# EAGLE design HoneyPI_Platine_2.02 (EAGLE 9.6.2)
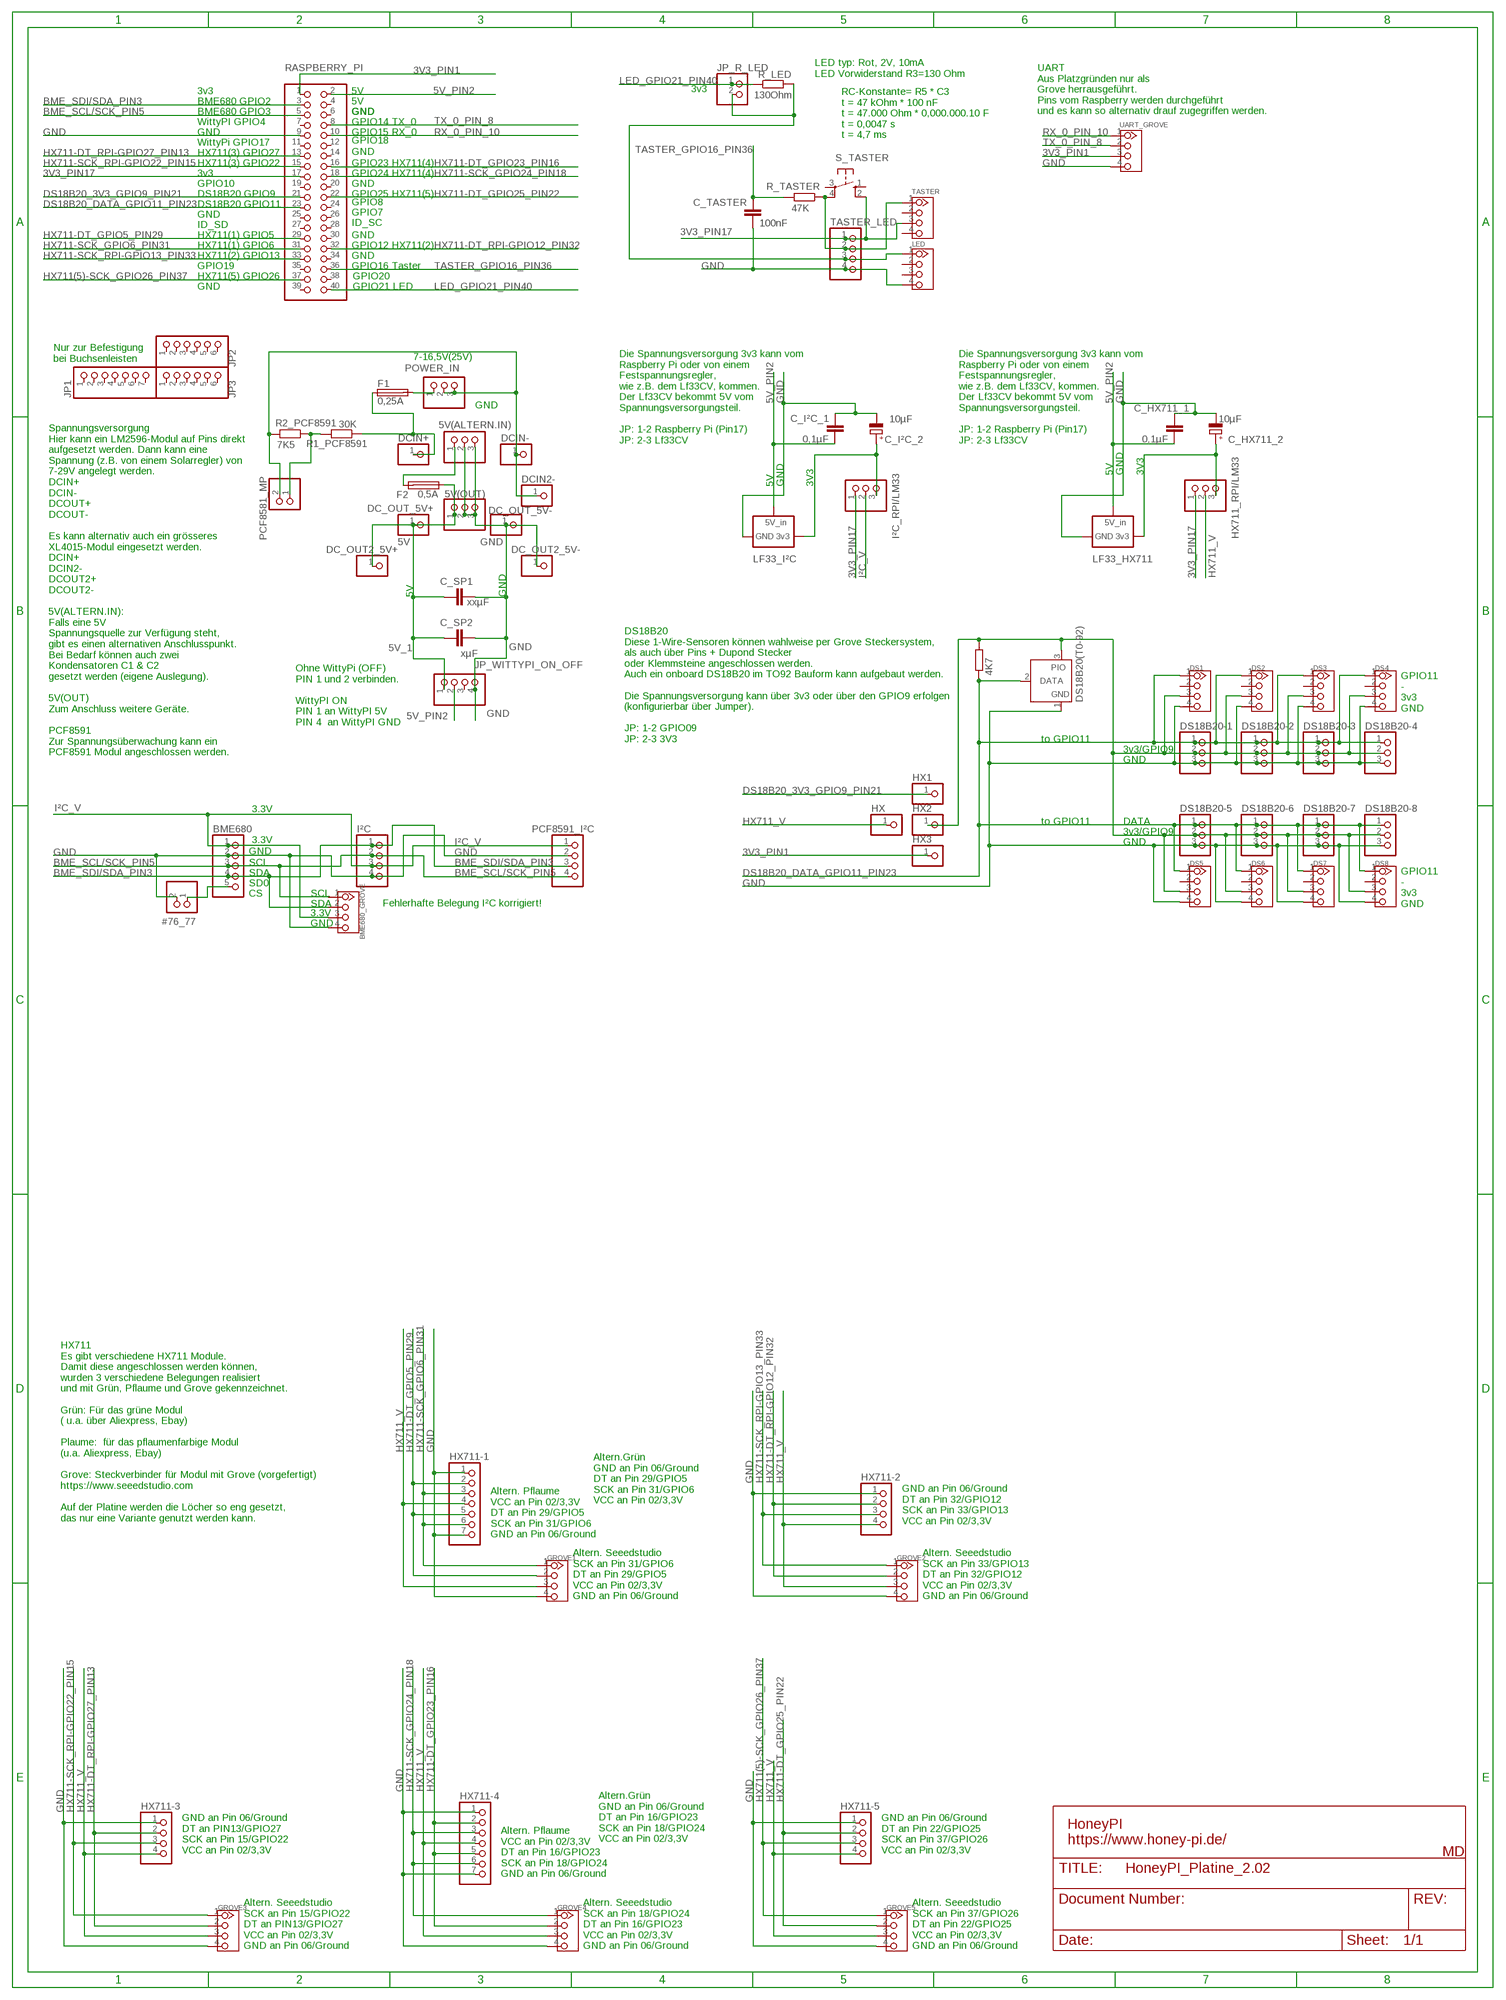
[diagram p0: schematic, sheet 1]

## Parts
5V(ALTERN.IN)  PINHD-1X3  [1X03]
5V(OUT)  PINHD-1X3  [1X03]
#76_77  PINHD-1X2  [1X02]
BME680  PINHD-1X5  [1X05]
BME680_GROVE  TWIG-4P-2.0-2.0  [4P-2.0]
C_HX711_1  0,1µF  C2,5-3  [C2.5-3]
C_HX711_2  10µF  CPOL-EUE2-5  [E2-5]
C_I²C_1  0,1µF  C2,5-3  [C2.5-3]
C_I²C_2  10µF  CPOL-EUE2-5  [E2-5]
C_SP1  xxµF  C2,5-3  [C2.5-3]
C_SP2  xµF  C2,5-3  [C2.5-3]
C_TASTER  100nF  C2,5-3  [C2.5-3]
DC_OUT2_5V+  PINHD-1X1  [1X01]
DC_OUT2_5V-  PINHD-1X1  [1X01]
DC_OUT_5V+  5V  PINHD-1X1  [1X01]
DC_OUT_5V-  GND  PINHD-1X1  [1X01]
DCIN2-  PINHD-1X1  [1X01]
DCIN+  PINHD-1X1  [1X01]
DCIN-  PINHD-1X1  [1X01]
DS1  TWIG-4P-2.0-2.0  [4P-2.0]
DS2  TWIG-4P-2.0-2.0  [4P-2.0]
DS3  TWIG-4P-2.0-2.0  [4P-2.0]
DS4  TWIG-4P-2.0-2.0  [4P-2.0]
DS5  TWIG-4P-2.0-2.0  [4P-2.0]
DS6  TWIG-4P-2.0-2.0  [4P-2.0]
DS7  TWIG-4P-2.0-2.0  [4P-2.0]
DS8  TWIG-4P-2.0-2.0  [4P-2.0]
DS18B20(T0-92)  DS18b20  DS2405  [TO92-]
DS18B20-1  PINHD-1X3  [1X03]
DS18B20-2  PINHD-1X3  [1X03]
DS18B20-3  PINHD-1X3  [1X03]
DS18B20-4  PINHD-1X3  [1X03]
DS18B20-5  PINHD-1X3  [1X03]
DS18B20-6  PINHD-1X3  [1X03]
DS18B20-7  PINHD-1X3  [1X03]
DS18B20-8  PINHD-1X3  [1X03]
F1  0,25A  TR5  [TR5]
F2  0,5A  TR5  [TR5]
GROVE1  TWIG-4P-2.0-2.0  [4P-2.0]
GROVE2  TWIG-4P-2.0-2.0  [4P-2.0]
GROVE3  TWIG-4P-2.0-2.0  [4P-2.0]
GROVE4  TWIG-4P-2.0-2.0  [4P-2.0]
GROVE5  TWIG-4P-2.0-2.0  [4P-2.0]
HX  PINHD-1X1  [1X01]
HX1  PINHD-1X1  [1X01]
HX2  PINHD-1X1  [1X01]
HX3  PINHD-1X1  [1X01]
HX711-1  PINHD-1X7  [1X07]
HX711-2  PINHD-1X4  [1X04]
HX711-3  PINHD-1X4  [1X04]
HX711-4  PINHD-1X7  [1X07]
HX711-5  PINHD-1X4  [1X04]
HX711_RPI/LM33  PINHD-1X3  [1X03]
I²C  PINHD-1X4  [1X04]
I²C_RPI/LM33  PINHD-1X3  [1X03]
JP1  PINHD-1X7  [1X07]
JP2  PINHD-1X6  [1X06]
JP3  PINHD-1X6  [1X06]
JP_R_LED  PINHD-1X2  [1X02]
JP_WITTYPI_ON_OFF  PINHD-1X4  [1X04]
LED  TWIG-4P-2.0-2.0  [4P-2.0]
LF33_HX711  LM33CV  [337TS]
LF33_I²C  LM33CV  [337TS]
PCF8581_MP  PINHD-1X2  [1X02]
PCF8591_I²C  PINHD-1X4  [1X04]
POWER_IN  PINHD-1X3  [1X03]
R1_PCF8591  30K  R-EU_0204/7  [0204/7]
R2_PCF8591  7K5  R-EU_0204/7  [0204/7]
R_DS18B20  4K7  R-EU_0204/7  [0204/7]
R_LED  130Ohm  R-EU_0204/7  [0204/7]
R_TASTER  47K  R-EU_0204/7  [0204/7]
RASPBERRY_PI  PINHD-2X20  [2X20]
S_TASTER  10-XX  [B3F-10XX]
TASTER  TWIG-4P-2.0-2.0  [4P-2.0]
TASTER_LED  PINHD-1X4  [1X04]
UART_GROVE  TWIG-4P-2.0-2.0  [4P-2.0]

## Nets
3V3 [Supply3v3]: DS1.3 DS2.3 DS3.3 DS4.3 DS5.3 DS6.3 DS7.3 DS8.3 DS18B20(T0-92).3(PIO) DS18B20-1.2 DS18B20-2.2 DS18B20-3.2 DS18B20-4.2 DS18B20-5.2 DS18B20-6.2 DS18B20-7.2 DS18B20-8.2 HX2.1 R_DS18B20.2
3V3_PIN1 [Supply3v3]: HX3.1 RASPBERRY_PI.1 UART_GROVE.3
3V3_PIN17 [Supply3v3]: HX711_RPI/LM33.1 I²C_RPI/LM33.1 RASPBERRY_PI.17 S_TASTER.2(S1) TASTER.3 TASTER_LED.1
5V_1: 5V(OUT).1 C_SP1.1 C_SP2.1 DC_OUT2_5V+.1 DC_OUT_5V+.1 F2.1 JP_WITTYPI_ON_OFF.1
5V_PIN2 [Supply5v]: C_HX711_1.1 C_I²C_1.1 JP_WITTYPI_ON_OFF.2 LF33_HX711.1(5V) LF33_I²C.1(5V) RASPBERRY_PI.2
BME_SCL/SCK_PIN5: BME680.3 BME680_GROVE.1 I²C.2 PCF8591_I²C.4 RASPBERRY_PI.5
BME_SDI/SDA_PIN3: BME680.4 BME680_GROVE.2 I²C.1 PCF8591_I²C.3 RASPBERRY_PI.3
DS18B20_3V3_GPIO9_PIN21 [Supply3v3]: HX1.1 RASPBERRY_PI.21
DS18B20_DATA_GPIO11_PIN23: DS1.1 DS2.1 DS3.1 DS4.1 DS5.1 DS6.1 DS7.1 DS8.1 DS18B20(T0-92).2(DATA) DS18B20-1.1 DS18B20-2.1 DS18B20-3.1 DS18B20-4.1 DS18B20-5.1 DS18B20-6.1 DS18B20-7.1 DS18B20-8.1 R_DS18B20.1 RASPBERRY_PI.23
GND [Supply5v]: 5V(ALTERN.IN).2 5V(ALTERN.IN).3 5V(OUT).2 5V(OUT).3 #76_77.2 BME680.2 BME680_GROVE.4 C_HX711_1.2 C_HX711_2.- C_I²C_1.2 C_I²C_2.- C_SP1.2 C_SP2.2 C_TASTER.1 DC_OUT2_5V-.1 DC_OUT_5V-.1 DS1.4 DS2.4 DS3.4 DS4.4 DS5.4 DS6.4 DS7.4 DS8.4 DS18B20(T0-92).1(GND) DS18B20-1.3 DS18B20-2.3 DS18B20-3.3 DS18B20-4.3 DS18B20-5.3 DS18B20-6.3 DS18B20-7.3 DS18B20-8.3 GROVE1.4 GROVE2.4 GROVE3.4 GROVE4.4 GROVE5.4 HX711-1.1 HX711-1.7 HX711-2.1 HX711-3.1 HX711-4.1 HX711-4.7 HX711-5.1 I²C.4 JP_WITTYPI_ON_OFF.4 LED.4 LF33_HX711.2(GND) LF33_I²C.2(GND) PCF8591_I²C.2 RASPBERRY_PI.9 TASTER_LED.4 UART_GROVE.4
GND20V [Suppy20V]: DCIN2-.1 DCIN-.1 PCF8581_MP.2 POWER_IN.2 POWER_IN.3 R2_PCF8591.2
HX711(5)-SCK_GPIO26_PIN37: GROVE5.1 HX711-5.3 RASPBERRY_PI.37
HX711-DT_GPIO5_PIN29: GROVE1.2 HX711-1.2 HX711-1.5 RASPBERRY_PI.29
HX711-DT_GPIO23_PIN16: GROVE4.2 HX711-4.2 HX711-4.5 RASPBERRY_PI.16
HX711-DT_GPIO25_PIN22: GROVE5.2 HX711-5.2 RASPBERRY_PI.22
HX711-DT_RPI-GPIO12_PIN32: GROVE2.2 HX711-2.2 RASPBERRY_PI.32
HX711-DT_RPI-GPIO27_PIN13: GROVE3.2 HX711-3.2 RASPBERRY_PI.13
HX711-SCK_GPIO6_PIN31: GROVE1.1 HX711-1.3 HX711-1.6 RASPBERRY_PI.31
HX711-SCK_GPIO24_PIN18: GROVE4.1 HX711-4.3 HX711-4.6 RASPBERRY_PI.18
HX711-SCK_RPI-GPIO13_PIN33: GROVE2.1 HX711-2.3 RASPBERRY_PI.33
HX711-SCK_RPI-GPIO22_PIN15: GROVE3.1 HX711-3.3 RASPBERRY_PI.15
HX711_V [Supply3v3]: GROVE1.3 GROVE2.3 GROVE3.3 GROVE4.3 GROVE5.3 HX711-1.4 HX711-2.4 HX711-3.4 HX711-4.4 HX711-5.4 HX711_RPI/LM33.2 HX.1
I²C_V [Supply3v3]: BME680.1 BME680_GROVE.3 I²C.3 I²C_RPI/LM33.2 PCF8591_I²C.1
LED_2: JP_R_LED.2 LED.1 R_LED.2 TASTER_LED.3
LED_GPIO21_PIN40 [Supply3v3]: JP_R_LED.1 R_LED.1 RASPBERRY_PI.40
N$2: C_I²C_2.+ I²C_RPI/LM33.3 LF33_I²C.3(OUT3V3)
N$3: R_TASTER.1 S_TASTER.4(P1) TASTER.1 TASTER_LED.2
N$4: C_HX711_2.+ HX711_RPI/LM33.3 LF33_HX711.3(OUT3V3)
N$8: #76_77.1 BME680.5
N$9 [Supply5v]: 5V(ALTERN.IN).1 F2.2
RX_0_PIN_10: RASPBERRY_PI.10 UART_GROVE.1
SPANNUNGSTEILER1: PCF8581_MP.1 R1_PCF8591.2 R2_PCF8591.1
TASTER_GPIO16_PIN36: C_TASTER.2 R_TASTER.2 RASPBERRY_PI.36
TX_0_PIN_8: RASPBERRY_PI.8 UART_GROVE.2
VDD20V1 [Suppy20V]: DCIN+.1 F1.1 R1_PCF8591.1
VDD20V2 [Suppy20V]: F1.2 POWER_IN.1
Unconnected: DS1.2 DS2.2 DS3.2 DS4.2 DS5.2 DS6.2 DS7.2 DS8.2 JP1.1 JP1.2 JP1.3 JP1.4 JP1.5 JP1.6 JP1.7 JP2.1 JP2.2 JP2.3 JP2.4 JP2.5 JP2.6 JP3.1 JP3.2 JP3.3 JP3.4 JP3.5 JP3.6 JP_WITTYPI_ON_OFF.3 LED.2 LED.3 RASPBERRY_PI.4 RASPBERRY_PI.6 RASPBERRY_PI.7 RASPBERRY_PI.11 RASPBERRY_PI.12 RASPBERRY_PI.14 RASPBERRY_PI.19 RASPBERRY_PI.20 RASPBERRY_PI.24 RASPBERRY_PI.25 RASPBERRY_PI.26 RASPBERRY_PI.27 RASPBERRY_PI.28 RASPBERRY_PI.30 RASPBERRY_PI.34 RASPBERRY_PI.35 RASPBERRY_PI.38 RASPBERRY_PI.39 S_TASTER.1(S) S_TASTER.3(P) TASTER.2 TASTER.4

## Notes on the sheet
- LED typ: Rot, 2V, 10mA
  LED Vorwiderstand R3=130 Ohm
- 3v3 | 5V | 3v3
- BME680 GPIO2 | 5V
- BME680 GPIO3 | GND | GND
- WittyPI GPIO4 | GPIO14 TX_0
- UART
  Aus Platzgründen nur als
  Grove herrausgeführt. 
  Pins vom Raspberry werden durchgeführt
  und es kann so alternativ drauf zugegriffen werden.
- GND | GPIO15 RX_0
- WittyPi GPIO17 | GPIO18
- RC-Konstante= R5 * C3
  t = 47 kOhm * 100 nF    
  t = 47.000 Ohm * 0,000.000.10 F
  t = 0,0047 s
  t = 4,7 ms
- HX711(3) GPIO27 | GND
- HX711(3) GPIO22 | GPIO23 HX711(4)
- 3v3 | GPIO24 HX711(4)
- GPIO10 | GND
- DS18B20 GPIO9 | GPIO25 HX711(5)
- DS18B20 GPIO11 | GPIO8
- GND | GPIO7
- ID_SD | ID_SC
- HX711(1) GPIO5 | GND
- HX711(1) GPIO6 | GPIO12 HX711(2)
- HX711(2) GPIO13 | GND
- GPIO19 | GPIO16 Taster
- HX711(5) GPIO26 | GPIO20
- GND | GPIO21 LED
- 7-16,5V(25V)
- Nur zur Befestigung
  bei Buchsenleisten
- GND
- Die Spannungsversorgung 3v3 kann vom
  Raspberry Pi oder von einem 
  Festspannungsregler, 
  wie z.B. dem Lf33CV, kommen.
  Der Lf33CV bekommt 5V vom
  Spannungsversorgungsteil.
  
  JP: 1-2 Raspberry Pi (Pin17)
  JP: 2-3 Lf33CV
- Die Spannungsversorgung 3v3 kann vom
  Raspberry Pi oder von einem 
  Festspannungsregler, 
  wie z.B. dem Lf33CV, kommen.
  Der Lf33CV bekommt 5V vom
  Spannungsversorgungsteil.
  
  JP: 1-2 Raspberry Pi (Pin17)
  JP: 2-3 Lf33CV
- 5V | GND | 3V3
- 5V | GND | 3V3
- 5V | GND
- GPIO11
  -
  3v3
  GND
- Ohne WittyPi (OFF)
  PIN 1 und 2 verbinden.
  
  WittyPI ON
  PIN 1 an WittyPI 5V 
  PIN 4  an WittyPI GND
- DS18B20
  Diese 1-Wire-Sensoren können wahlweise per Grove Steckersystem,
  als auch über Pins + Dupond Stecker
  oder Klemmsteine angeschlossen werden.
  Auch ein onboard DS18B20 im TO92 Bauform kann aufgebaut werden. 
  
  Die Spannungsversorgung kann über 3v3 oder über den GPIO9 erfolgen
  (konfigurierbar über Jumper).
  
  JP: 1-2 GPIO09
  JP: 2-3 3V3
- to GPIO11
- 3v3/GPIO9
- Spannungsversorgung
  Hier kann ein LM2596-Modul auf Pins direkt
  aufgesetzt werden. Dann kann eine
  Spannung (z.B. von einem Solarregler) von
  7-29V angelegt werden.
  DCIN+
  DCIN-
  DCOUT+
  DCOUT-
  
  Es kann alternativ auch ein grösseres
  XL4015-Modul eingesetzt werden. 
  DCIN+
  DCIN2-
  DCOUT2+
  DCOUT2-
  
  5V(ALTERN.IN):
  Falls eine 5V
  Spannungsquelle zur Verfügung steht,
  gibt es einen alternativen Anschlusspunkt.
  Bei Bedarf können auch zwei
  Kondensatoren C1 & C2
  gesetzt werden (eigene Auslegung).   
  
  5V(OUT)
  Zum Anschluss weitere Geräte.
  
  PCF8591
  Zur Spannungsüberwachung kann ein
  PCF8591 Modul angeschlossen werden.
- GND
- 3.3V
- to GPIO11 | DATA
- 3v3/GPIO9
- 3.3V | GND
- GND
- SCL
- SDA
- SD0
- CS | SCL
- SDA
- GPIO11
  -
  3v3
  GND
- 3.3V | Fehlerhafte Belegung I²C korrigiert!
- GND
- Altern.Grün
  GND an Pin 06/Ground
  DT an Pin 29/GPIO5
  SCK an Pin 31/GPIO6
  VCC an Pin 02/3,3V
- HX711
  Es gibt verschiedene HX711 Module.
  Damit diese angeschlossen werden können,
  wurden 3 verschiedene Belegungen realisiert
  und mit Grün, Pflaume und Grove gekennzeichnet.
  
  Grün: Für das grüne Modul 
  ( u.a. über Aliexpress, Ebay)
  
  Plaume:  für das pflaumenfarbige Modul 
  (u.a. Aliexpress, Ebay) 
  
  Grove: Steckverbinder für Modul mit Grove (vorgefertigt)
  https://www.seeedstudio.com
  
  Auf der Platine werden die Löcher so eng gesetzt,
  das nur eine Variante genutzt werden kann.
- GND an Pin 06/Ground
  DT an Pin 32/GPIO12
  SCK an Pin 33/GPIO13
  VCC an Pin 02/3,3V
- Altern. Pflaume
  VCC an Pin 02/3,3V
  DT an Pin 29/GPIO5
  SCK an Pin 31/GPIO6
  GND an Pin 06/Ground
- Altern. Seeedstudio
  SCK an Pin 31/GPIO6
  DT an Pin 29/GPIO5
  VCC an Pin 02/3,3V
  GND an Pin 06/Ground
- Altern. Seeedstudio
  SCK an Pin 33/GPIO13
  DT an Pin 32/GPIO12
  VCC an Pin 02/3,3V
  GND an Pin 06/Ground
- Altern.Grün
  GND an Pin 06/Ground
  DT an Pin 16/GPIO23
  SCK an Pin 18/GPIO24
  VCC an Pin 02/3,3V
- HoneyPI
  https://www.honey-pi.de/
- GND an Pin 06/Ground
  DT an PIN13/GPIO27
  SCK an Pin 15/GPIO22
  VCC an Pin 02/3,3V
- GND an Pin 06/Ground
  DT an Pin 22/GPIO25
  SCK an Pin 37/GPIO26
  VCC an Pin 02/3,3V
- MD
- Altern. Pflaume
  VCC an Pin 02/3,3V
  DT an Pin 16/GPIO23
  SCK an Pin 18/GPIO24
  GND an Pin 06/Ground
- Altern. Seeedstudio
  SCK an Pin 15/GPIO22
  DT an PIN13/GPIO27
  VCC an Pin 02/3,3V
  GND an Pin 06/Ground
- Altern. Seeedstudio
  SCK an Pin 18/GPIO24
  DT an Pin 16/GPIO23
  VCC an Pin 02/3,3V
  GND an Pin 06/Ground
- Altern. Seeedstudio
  SCK an Pin 37/GPIO26
  DT an Pin 22/GPIO25
  VCC an Pin 02/3,3V
  GND an Pin 06/Ground

## Library data of the parts
5V(ALTERN.IN) 5V(OUT) DS18B20-1-DS18B20-8 HX711_RPI/LM33 I²C_RPI/LM33 POWER_IN = pinhead:PINHD-1X3: PIN HEADER
#76_77 JP_R_LED PCF8581_MP = pinhead:PINHD-1X2: PIN HEADER
BME680 = pinhead:PINHD-1X5: PIN HEADER
BME680_GROVE DS1-DS8 GROVE1-GROVE5 LED TASTER UART_GROVE = Connector:TWIG-4P-2.0: Grove Stecker RM 2mm 4Pol
C_HX711_1 C_I²C_1 C_SP1 C_SP2 C_TASTER = capacitor-wima:C: CAPACITOR
C_HX711_2 C_I²C_2 = rcl:CPOL-EU: POLARIZED CAPACITOR, European symbol; SPICEPREFIX: C
DC_OUT2_5V+ DC_OUT2_5V- DC_OUT_5V+ DC_OUT_5V- DCIN2- DCIN+ DCIN- HX HX1-HX3 = pinhead:PINHD-1X1: PIN HEADER
DS18B20(T0-92) = maxim:DS2405: Addressable Switch DALLAS Semiconductor; MF: DALLAS SEMICONDUCTOR; MPN: DS2405; OC_FARNELL: 1188025; OC_NEWARK: 06F4645
F1 F2 = fuse:TR5: FUSE; OC_FARNELL: unknown; OC_NEWARK: unknown
HX711-1 HX711-4 JP1 = pinhead:PINHD-1X7: PIN HEADER
HX711-2 HX711-3 HX711-5 I²C JP_WITTYPI_ON_OFF PCF8591_I²C TASTER_LED = pinhead:PINHD-1X4: PIN HEADER
JP2 JP3 = pinhead:PINHD-1X6: PIN HEADER
LF33_HX711 LF33_I²C = LM33cv:LM33CV: VOLTAGE REGULATOR
R1_PCF8591 R2_PCF8591 R_DS18B20 R_LED R_TASTER = rcl:R-EU_: RESISTOR, European symbol; SPICEPREFIX: R
RASPBERRY_PI = pinhead:PINHD-2X20: PIN HEADER
S_TASTER = switch-omron:10-XX: OMRON SWITCH; MPN: B3F-1000; OC_FARNELL: 176432; OC_NEWARK: 36M3542

## Net classes
0 Signal: width 0.152 mm, clearance 0.254 mm
1 Supply3v3: width 0.152 mm, clearance 0.305 mm
2 Supply5v: width 0.5 mm, clearance 0.254 mm
4 Suppy20V: width 0.25 mm, clearance 0.762 mm

## Board
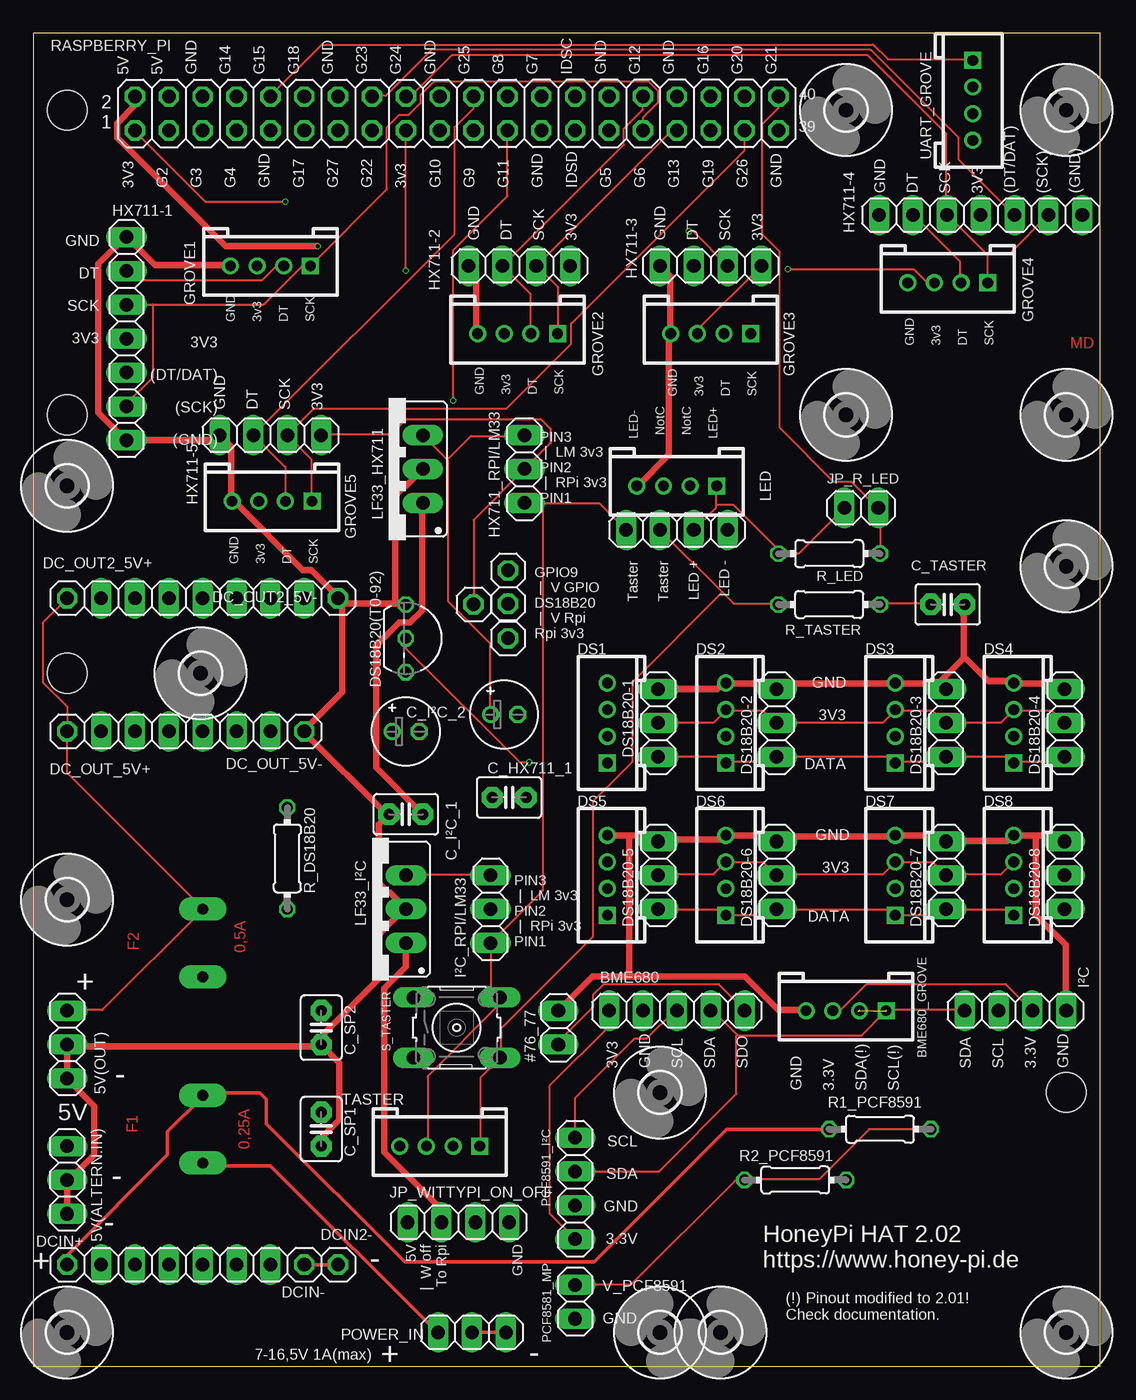
[diagram p1: board, top side]
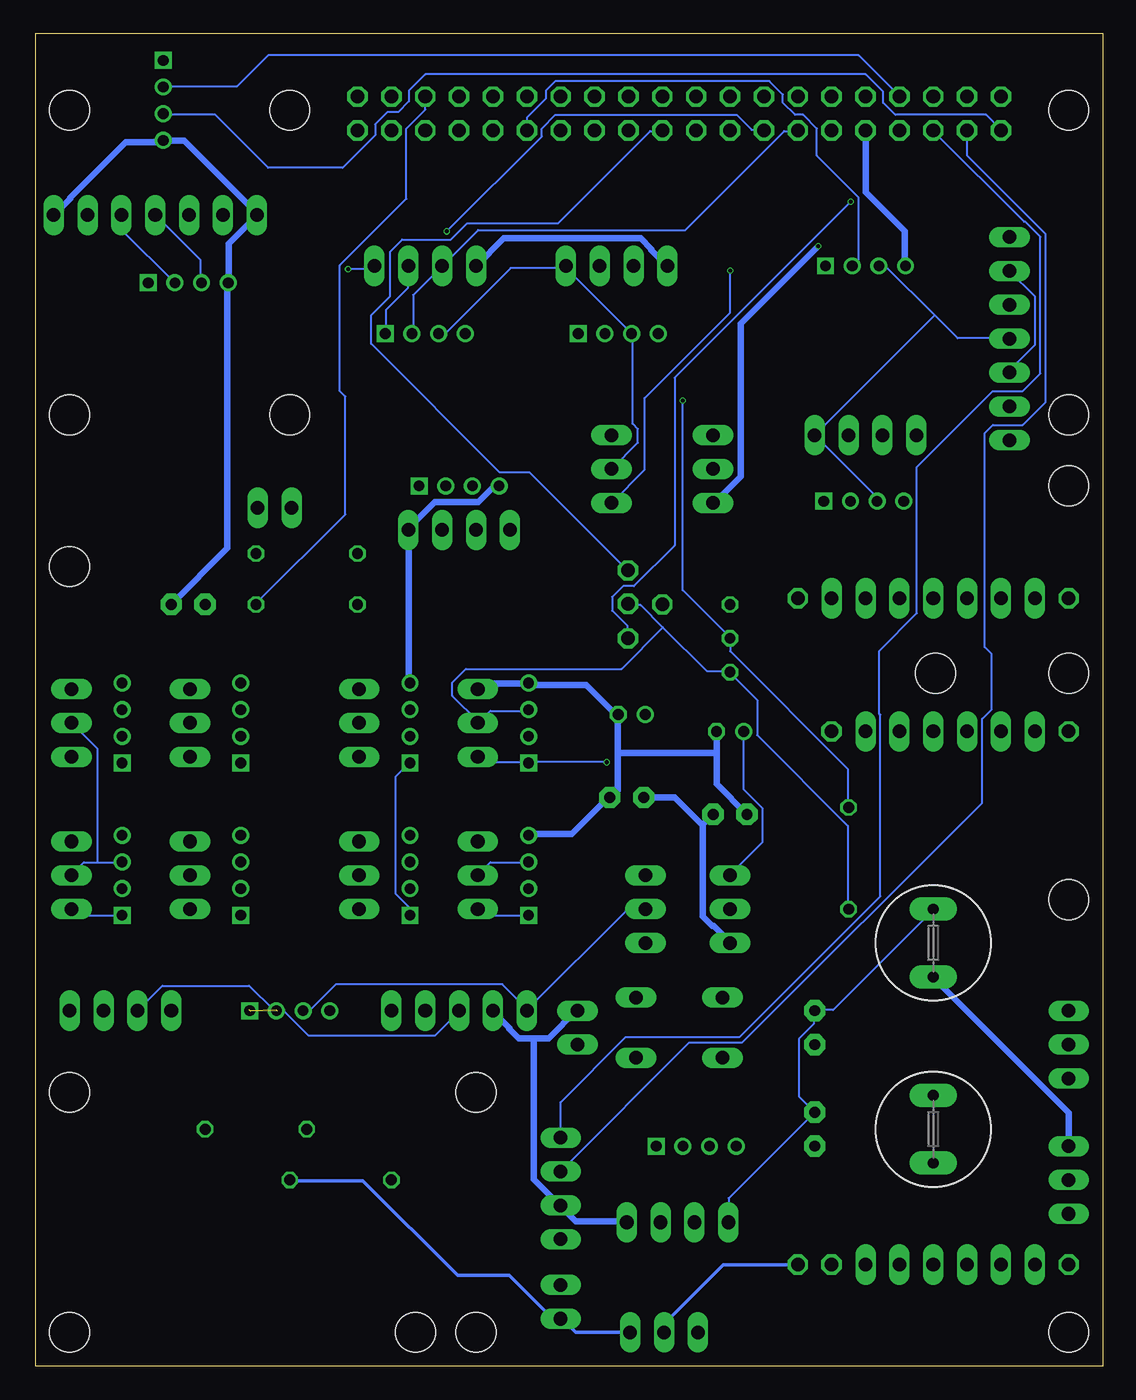
[diagram p2: board, bottom side, seen from below]

Size 80 x 100 mm. Coordinates in mm from the lower left corner, seen from the top.
Outline: 0,0 80,0 80,100 0,100 0,0
Copper layers (1*16): Top 0.035559375mm / dielectric 1.6mm / Bottom 0.035559375mm
Design rules "jlcpcb2layer": minimum track width 5mil, minimum drill 12mil, track to track 5mil, track to pad 5mil, pad to pad 5mil, via to via 5mil, smd to smd 5mil, copper to edge 8mil, drill to drill 6mil, minimum pad ring 5mil, minimum via ring 3mil, stop-mask expansion 2.5mil, vias tented up to drill 0mil, thermal gap 10mil
Holes 3 mm at 2.54,94.23 2.54,71.37 77.47,20.54 2.54,52

### Footprints (pad centres in the part's own frame; a part is rotated, then mirrored left to right if it is on the bottom)
1X03 = drill 1.016 long: 1 -2.54,0; 2 0,0; 3 2.54,0
1X02 = drill 1.016 long: 1 -1.27,0; 2 1.27,0
1X05 = drill 1.016 long: 1 -5.08,0; 2 -2.54,0; 3 0,0; 4 2.54,0; 5 5.08,0
4P-2.0 = drill 0.8 pad 1.27 square: 1 -3,0 | drill 0.8 pad 1.27: 2 -1,0; 3 1,0; 4 3,0
C2.5-3 = drill 0.813 pad 1.6 octagon: 1 -1.27,0; 2 1.27,0
E2-5 = drill 0.813 pad 1.27: + -1.016,0 | drill 0.813 pad 1.27 octagon: - 1.016,0
1X01 = drill 1.016 octagon: 1 0,0
TO92- = drill 0.813 octagon: 1 -2.54,0; 2 0,0; 3 2.54,0
TR5 = drill 0.813 pad 1.778 long: 1 -2.54,0; 2 2.54,0
1X07 = drill 1.016 long: 1 -7.62,0; 2 -5.08,0; 3 -2.54,0; 4 0,0; 5 2.54,0; 6 5.08,0; 7 7.62,0
1X04 = drill 1.016 long: 1 -3.81,0; 2 -1.27,0; 3 1.27,0; 4 3.81,0
1X06 = drill 1.016 long: 1 -6.35,0; 2 -3.81,0; 3 -1.27,0; 4 1.27,0; 5 3.81,0; 6 6.35,0
337TS = drill 1.016 long: 1 -2.54,-2.54; 2 0,-2.54; 3 2.54,-2.54
0204/7 = drill 0.813 octagon: 1 -3.81,0; 2 3.81,0
2X20 = drill 1.016 octagon: 1 -24.13,-1.27; 2 -24.13,1.27; 3 -21.59,-1.27; 4 -21.59,1.27; 5 -19.05,-1.27; 6 -19.05,1.27; 7 -16.51,-1.27; 8 -16.51,1.27; 9 -13.97,-1.27; 10 -13.97,1.27; 11 -11.43,-1.27; 12 -11.43,1.27; 13 -8.89,-1.27; 14 -8.89,1.27; 15 -6.35,-1.27; 16 -6.35,1.27; 17 -3.81,-1.27; 18 -3.81,1.27; 19 -1.27,-1.27; 20 -1.27,1.27; 21 1.27,-1.27; 22 1.27,1.27; 23 3.81,-1.27; 24 3.81,1.27; 25 6.35,-1.27; 26 6.35,1.27; 27 8.89,-1.27; 28 8.89,1.27; 29 11.43,-1.27; 30 11.43,1.27; 31 13.97,-1.27; 32 13.97,1.27; 33 16.51,-1.27; 34 16.51,1.27; 35 19.05,-1.27; 36 19.05,1.27; 37 21.59,-1.27; 38 21.59,1.27; 39 24.13,-1.27; 40 24.13,1.27
B3F-10XX = drill 1.016 long: 1 -3.251,2.261; 2 3.251,2.261; 3 -3.251,-2.261; 4 3.251,-2.261
3,0 = hole 3: 0,0

### Placement (x,y rotation side)
5V(ALTERN.IN)  2.54,13.97 270 top
5V(OUT)  2.54,24.13 270 top
#76_77  39.37,25.4 90 top
BME680  48.26,26.67 0 top
BME680_GROVE  60.96,26.67 180 top
C_HX711_1  35.69,42.67 0 top
C_HX711_2  35.31,48.9 0 top
C_I²C_1  27.94,41.4 180 top
C_I²C_2  27.94,47.62 0 top
C_SP1  21.59,17.78 270 top
C_SP2  21.59,25.4 270 top
C_TASTER  68.58,57.15 180 top
DC_OUT2_5V+  2.54,57.62 0 top
DC_OUT2_5V-  22.86,57.62 0 top
DC_OUT_5V+  2.54,47.62 0 top
DC_OUT_5V-  20.32,47.62 0 top
DCIN2-  22.86,7.62 0 top
DCIN+  2.54,7.62 0 top
DCIN-  20.32,7.62 0 top
DS1  43.05,48.26 90 top
DS2  51.94,48.26 90 top
DS3  64.64,48.26 90 top
DS4  73.53,48.26 90 top
DS5  43.05,36.83 90 top
DS6  51.94,36.83 90 top
DS7  64.64,36.83 90 top
DS8  73.53,36.83 90 top
DS18B20(T0-92)  27.94,54.61 270 top
DS18B20-1  46.86,48.26 90 top
DS18B20-2  55.75,48.26 90 top
DS18B20-3  68.45,48.26 90 top
DS18B20-4  77.34,48.26 90 top
DS18B20-5  46.86,36.83 90 top
DS18B20-6  55.75,36.83 90 top
DS18B20-7  68.45,36.83 90 top
DS18B20-8  77.34,36.83 90 top
F1  12.7,17.78 270 bottom
F2  12.7,31.75 270 bottom
GROVE1  17.78,82.55 180 top
GROVE2  36.32,77.47 180 top
GROVE3  50.8,77.47 180 top
GROVE4  68.58,81.28 180 top
GROVE5  17.91,64.9 180 top
HX  33.02,57.15 0 top
HX1  35.6,59.7 0 top
HX2  35.6,57.2 0 top
HX3  35.6,54.6 0 top
HX711-1  6.99,77.09 270 top
HX711-2  36.45,82.55 0 top
HX711-3  50.8,82.55 0 top
HX711-4  71.05,86.36 0 top
HX711-5  17.78,69.85 0 top
HX711_RPI/LM33  36.83,67.31 90 top
I²C  73.66,26.67 0 top
I²C_RPI/LM33  34.29,34.29 90 top
JP1  12.7,57.62 0 top
JP2  11.43,7.62 0 top
JP3  11.43,47.62 0 top
JP_R_LED  62.1,64.4 180 top
JP_WITTYPI_ON_OFF  31.88,10.79 0 top
LED  48.26,66.04 180 top
LF33_HX711  26.67,67.31 90 top
LF33_I²C  25.4,34.29 90 top
PCF8581_MP  40.64,4.83 270 top
PCF8591_I²C  40.64,13.34 90 top
POWER_IN  32.89,2.54 0 top
R1_PCF8591  63.5,17.78 0 top
R2_PCF8591  57.15,13.97 0 top
R_DS18B20  19.05,38.1 270 top
R_LED  59.69,60.96 180 top
R_TASTER  59.69,57.15 0 top
RASPBERRY_PI  31.75,93.98 0 top
S_TASTER  31.75,25.4 0 top
TASTER  30.48,16.51 180 top
TASTER_LED  48.26,62.74 0 top
U$1  [3,0]  77.47,71.37 0 top
U$2  [3,0]  51.54,2.54 0 top
U$3  [3,0]  77.47,2.54 0 top
U$4  [3,0]  2.54,2.54 0 top
U$5  [3,0]  46.99,20.54 0 top
U$6  [3,0]  46.99,2.54 270 top
U$7  [3,0]  60.96,71.37 0 top
U$8  [3,0]  2.54,66.04 0 top
U$9  [3,0]  2.54,35 0 top
U$10  [3,0]  77.47,60 0 top
U$11  [3,0]  12.54,52 0 top
U$12  [3,0]  77.47,94.23 0 top
U$13  [3,0]  60.96,94.23 0 top
UART_GROVE  70.45,94.97 270 top

### Tracks (layer width: path | path; a pad name or v marks a point on that pad's centre or on a via)
3V3
  Top 0.152: DS18B20-5.2 46.94,36.88 51,36.88 51.92,37.8 DS6.3 52.02,37.8 54.76,37.8 55.68,36.88 DS18B20-6.2 55.78,36.88 63.7,36.88 64.62,37.8 DS7.3 64.72,37.8 67.46,37.8 68.38,36.88 DS18B20-7.2 68.48,36.88 72.54,36.88 73.46,37.8 DS8.3 | DS18B20-1.2 51,48.26 51.92,49.17 DS2.3 52.02,49.17 54.76,49.17 55.68,48.26 DS18B20-2.2 63.7,48.26 64.62,49.17 DS3.3 64.72,49.17 67.46,49.17 68.38,48.26 DS18B20-3.2 72.54,48.26 73.46,49.17 DS4.3 73.56,49.17 76.4,49.17 77.32,48.26 DS18B20-4.2
  Bottom 0.152: R_DS18B20.2 19.1,34.34 19.1,40.54 25.91,47.35 25.91,49.99 27.94,52.02 DS18B20(T0-92).3 27.94,52.12 29.67,52.12 32.97,55.42 | 32.97,55.42 34.65,57.1 35.56,57.1 HX2.1 | DS5.3 43.08,37.8 45.92,37.8 46.84,36.88 DS18B20-5.2 | 75.39,37.8 76.4,37.8 77.32,36.88 DS18B20-8.2 | 75.39,37.8 73.56,37.8 DS8.3 | DS1.3 43.08,49.17 45.92,49.17 46.84,48.26 DS18B20-1.2 46.84,48.36 48.77,50.29 48.77,51.31 47.75,52.32 36.07,52.32 32.97,55.42 | 75.39,37.8 75.39,46.33 77.32,48.26 DS18B20-4.2
3V3_PIN1  (via drill 0.3)
  Top 0.152: v18.9,87.38 12.9,87.38 7.62,92.66 RASPBERRY_PI.1
  Bottom 0.152: UART_GROVE.3 70.41,93.88 66.55,93.88 62.59,89.92 57,89.92 54.56,92.35 54.56,93.17 53.65,94.08 52.83,94.08 52.02,94.89 52.02,95.71 50.8,96.93 17.78,96.93 16.46,95.61 16.46,94.79 15.54,93.88 8.74,93.88 7.62,92.76 RASPBERRY_PI.1 | v18.9,87.38 32.11,74.17 32.11,61.57 35.15,58.52 35.97,58.52 36.78,57.71 36.78,56.69 35.66,55.58 35.66,54.66 HX3.1
3V3_PIN17  (via drill 0.3)
  Top 0.152: TASTER.3 29.57,16.56 29.57,21.74 34.95,27.13 34.95,27.64 S_TASTER.2 34.95,27.74 34.34,28.35 34.34,31.7 I²C_RPI/LM33.1 38.2,35.66 38.2,64.72 | 38.2,64.72 42.47,64.72 TASTER_LED.1 | 38.2,64.72 36.88,64.72 HX711_RPI/LM33.1 38.2,64.72 | v27.94,82.19 RASPBERRY_PI.17
  Bottom 0.152: v27.94,82.19 27.94,79.05 34.34,72.64 34.34,67.26 HX711_RPI/LM33.1
5V_1
  Top 0.152: DC_OUT2_5V+.1 2.54,57.61 0.71,55.78 0.71,51.31 2.54,49.48 DC_OUT_5V+.1 2.54,44.5 12.7,34.34 F2.1 12.7,34.24 5.18,26.72 2.54,26.72 5V(OUT).1
  Bottom 0.152: JP_WITTYPI_ON_OFF.1 28.04,10.87 28.04,12.6 C_SP1.1 22.76,20.22 22.76,24.59 21.64,25.7 21.64,26.62 C_SP2.1 21.54,26.72 20.22,26.72 12.7,34.24 F2.1
5V_PIN2  (via drill 0.3)
  Top 0.5: C_I²C_1.1 25.7,44.91 25.7,54.05 27.43,55.78 28.25,55.78 29.16,56.69 29.16,64.72 LF33_HX711.1 | RASPBERRY_PI.2 7.62,94.59 6.3,93.27 6.3,92.15 14.43,84.02 v21.34,84.02 | LF33_I²C.1 27.94,29.97 26.31,28.35 26.31,16.05 30.58,11.79 30.58,10.87 JP_WITTYPI_ON_OFF.2
  Bottom 0.5: 29.97,40.64 29.97,33.73 29.26,33.02 29.16,33.02 27.94,31.8 LF33_I²C.1 | C_I²C_1.1 29.97,40.64 | v21.34,84.02 27.13,78.23 27.13,66.75 29.16,64.72 LF33_HX711.1 | C_HX711_1.1 32.11,42.67 30.18,40.74 29.97,40.64
BME_SCL/SCK_PIN5  (2 unrouted)
  Top 0.152: PCF8591_I²C.4 40.64,20.12 45.11,24.59 46.02,24.59 48.06,26.62 48.26,26.62 BME680.3
  Bottom 0.152: 61.98,26.72 62.18,26.72 64.01,28.55 70.51,28.55 I²C.2 | PCF8591_I²C.4 40.64,19.81 35.76,24.69 27.23,24.69 16.66,35.26 16.66,48.87 16.76,48.97 16.76,53.65 13.92,56.49 13.92,67.46 8.23,73.15 5.99,73.15 4.67,74.47 4.67,84.73 5.79,85.85 5.89,85.85 12.7,92.66 RASPBERRY_PI.5 | 61.87,26.62 61.37,26.62 59.54,24.79 50.09,24.79 48.26,26.62 BME680.3
BME_SDI/SDA_PIN3  (2 unrouted)
  Top 0.152: 64.01,26.72 69.8,26.72 I²C.1 | 52.78,24.84 52.83,24.79 62.08,24.79 63.91,26.62 | 52.78,24.84 51,26.62 50.8,26.62 BME680.4 | 52.78,24.84 52.73,24.79 52.73,20.42 46.94,14.63 40.64,14.63 PCF8591_I²C.3
  Bottom 0.152: RASPBERRY_PI.3 10.16,90.83 4.27,84.94 4.27,72.34 5.99,70.61 8.23,70.61 8.84,70 8.84,53.95 8.33,53.44 8.33,49.28 9.04,48.56 9.04,42.27 27.03,24.28 30.99,24.28 40.64,14.63 PCF8591_I²C.3
DS18B20_3V3_GPIO9_PIN21
  Bottom 0.152: RASPBERRY_PI.21 33.02,92.66 33.93,92.66 40.84,85.75 47.65,85.75 48.87,84.53 52.53,84.53 53.44,83.62 53.44,80.26 54.86,78.84 54.86,76.71 45.21,67.06 42.98,67.06 35.66,59.74 HX1.1
DS18B20_DATA_GPIO11_PIN23  (via drill 0.3)
  Top 0.152: DS18B20-5.1 46.94,34.24 51.51,34.24 51.92,33.83 DS6.1 52.02,33.83 55.27,33.83 55.68,34.24 DS18B20-6.1 55.78,34.24 64.21,34.24 64.62,33.83 DS7.1 64.72,33.83 67.97,33.83 68.38,34.24 DS18B20-7.1 68.48,34.24 73.05,34.24 73.46,33.83 DS8.1 | DS18B20-1.1 51.51,45.72 51.92,45.31 DS2.1 52.02,45.31 55.27,45.31 55.68,45.72 DS18B20-2.1 64.21,45.72 64.62,45.31 DS3.1 64.72,45.31 67.97,45.31 68.38,45.72 DS18B20-3.1 73.05,45.72 73.46,45.31 DS4.1 73.56,45.31 76.91,45.31 77.32,45.72 DS18B20-4.1 | RASPBERRY_PI.23 35.56,87.78 31.5,83.72 v31.5,72.44 | v37.19,45.31 36.47,45.31 27.94,53.85 DS18B20(T0-92).2
  Bottom 0.152: DS5.1 43.08,33.83 46.43,33.83 46.84,34.24 DS18B20-5.1 | DS8.1 73.56,33.83 76.91,33.83 77.32,34.24 DS18B20-8.1 | DS18B20-1.1 46.84,45.72 46.43,45.31 43.08,45.31 DS1.1 42.98,45.31 v37.19,45.31 | DS6.1 52.02,33.83 52.02,34.44 53.03,35.46 53.03,44.2 52.02,45.21 DS2.1 | R_DS18B20.1 19.1,41.96 19.1,44.81 27.94,53.65 DS18B20(T0-92).2 27.94,54.66 31.5,58.22 v31.5,72.44
GND
  Top 0.5: GROVE2.4 33.22,77.52 33.22,81.99 32.72,82.5 HX711-2.1 | HX711-3.1 47.75,81.79 47.75,77.52 GROVE3.4 47.65,77.32 47.65,68.38 45.31,66.04 LED.4 | DS18B20-4.3 77.32,50.8 76.91,51.21 73.56,51.21 DS4.4 73.36,51.41 71.63,51.41 70,53.03 69.8,53.14 | 69.8,53.14 69.8,57.1 C_TASTER.1 | 69.8,53.14 68.07,51.41 DS18B20-3.3 68.38,50.8 67.97,51.21 64.72,51.21 DS3.4 64.41,51.21 56.29,51.21 55.98,50.9 DS18B20-2.3 55.68,50.8 55.27,51.21 52.02,51.21 DS2.4 51.71,51.21 51.31,50.8 DS18B20-1.3 | GROVE1.4 14.73,82.6 9.14,82.6 7.01,84.73 HX711-1.1 6.81,84.63 4.88,82.7 4.88,71.53 6.81,69.6 HX711-1.7 7.01,69.49 13.61,69.49 HX711-5.1 14.83,68.99 14.83,64.92 GROVE5.4 15.14,64.82 20.22,59.74 20.83,59.74 22.76,57.81 DC_OUT2_5V-.1 | 27.13,57.2 23.27,57.2 22.86,57.61 DC_OUT2_5V-.1 | 27.13,57.2 27.94,57.2 DS18B20(T0-92).1 | LF33_HX711.2 27.94,66.04 27.84,66.04 27.13,65.33 27.13,57.2 | 44.7,29.26 41.96,29.26 #76_77.2 | 44.7,29.26 53.34,29.26 55.88,26.72 57.91,26.72 BME680_GROVE.4 | 75.18,39.83 76.91,39.83 77.32,39.42 DS18B20-8.3 | 75.18,39.83 73.56,39.83 DS8.4 73.36,39.73 73.05,39.42 68.68,39.42 DS18B20-7.3 68.38,39.42 67.97,39.83 64.72,39.83 DS7.4 64.41,39.73 56.29,39.73 55.98,39.42 DS18B20-6.3 55.68,39.42 55.27,39.83 52.02,39.83 DS6.4 51.71,39.73 51.51,39.52 47.04,39.52 DS18B20-5.3 46.84,39.42 46.43,39.83 44.7,39.83 | 75.18,39.83 75.18,33.83 77.42,31.6 77.42,26.72 I²C.4 | 5V(ALTERN.IN).3 5V(ALTERN.IN).2 2.74,14.02 4.57,15.85 4.57,19.51 2.64,21.44 5V(OUT).3 5V(OUT).2 2.74,23.98 21.44,23.98 C_SP2.2 | 44.7,39.83 43.08,39.83 DS5.4 | C_SP2.2 22.96,22.76 22.96,18.49 21.64,17.17 21.64,16.56 C_SP1.2
  Top 0.5: C_SP2.2 21.74,24.28 21.74,24.89 25.91,29.06 25.91,32.41 27.74,34.24 LF33_I²C.2 27.94,34.34 26.72,35.56 26.62,35.56 25.91,36.27 25.91,40.64 C_I²C_1.2 26.42,41.45 20.32,47.55 DC_OUT_5V-.1 20.42,47.85 23.16,50.6 23.16,57 DC_OUT2_5V-.1 | 44.7,39.83 44.7,29.26
  Bottom 0.5: HX711-4.7 78.64,86.36 77.42,87.58 77.42,87.68 73.25,91.85 70.61,91.85 UART_GROVE.4 70.41,91.95 68.89,91.95 63.5,86.56 HX711-4.1 63.4,86.36 65.53,84.23 65.53,81.28 GROVE4.4 65.63,81.08 65.63,61.37 C_TASTER.1 | HX711-3.1 44.91,84.63 34.65,84.63 33.83,83.82 33.83,83.72 32.72,82.6 HX711-2.1 | LED.4 45.62,66.04 46.84,64.82 50.09,64.82 52.12,62.79 TASTER_LED.4 52.02,62.59 52.02,51.31 DS2.4 | DS18B20-1.3 46.84,50.8 46.43,51.21 43.08,51.21 DS1.4 42.88,51.1 38.71,51.1 36.58,48.97 C_HX711_2.- 36.37,48.87 36.37,46.02 | RASPBERRY_PI.9 17.78,88.09 14.83,85.14 14.83,82.6 GROVE1.4 | JP_WITTYPI_ON_OFF.4 35.76,10.87 39.52,10.87 40.64,11.99 PCF8591_I²C.2 40.84,12.19 42.67,14.02 42.67,24.59 | 42.67,24.59 41.55,24.59 39.42,26.72 #76_77.2 | 42.67,24.59 43.79,24.59 44.5,25.3 44.5,25.4 45.72,26.62 BME680.2 | 36.37,46.02 36.37,43.18 36.88,42.67 C_HX711_1.2 37.19,42.57 39.83,39.93 42.98,39.93 DS5.4 | 28.96,46.02 28.96,43.69 C_I²C_1.2 | 28.96,46.02 C_I²C_2.- | 28.96,46.02 36.37,46.02
GND20V
  Top 0.25: DCIN2-.1 DCIN-.1 | POWER_IN.3 POWER_IN.2
  Bottom 0.25: R2_PCF8591.2 60.96,13.92 55.47,13.92 48.36,6.81 44.5,6.81 41.25,3.56 PCF8581_MP.2 40.54,3.56 39.52,2.54 POWER_IN.3 | DCIN2-.1 28.45,7.62 32.82,3.25 32.82,2.54 POWER_IN.2
HX711(5)-SCK_GPIO26_PIN37
  Top 0.152: GROVE5.1 20.83,64.92 20.83,68.07 HX711-5.3 21.03,71.83 35.46,71.83 40.34,76.71 40.34,78.23 53.34,91.24 RASPBERRY_PI.37
HX711-DT_GPIO5_PIN29
  Top 0.152: GROVE1.2 18.69,82.5 18.19,82.5 17.17,81.48 7.62,81.48 7.01,82.09 HX711-1.2
  Bottom 0.152: HX711-1.2 5.08,80.26 5.08,76.61 6.91,74.78 6.91,74.57 HX711-1.5 | RASPBERRY_PI.29 43.18,93.67 41.76,95.1 41.76,95.71 41.05,96.42 24.99,96.42 23.98,95.4 23.98,94.79 23.06,93.88 22.45,93.88 21.44,92.86 21.44,90.83 18.29,87.68 18.29,83.01 18.69,82.6 GROVE1.2
HX711-DT_GPIO23_PIN16
  Top 0.152: GROVE4.2 69.49,81.28 69.49,82.91 66.04,86.36 HX711-4.2 | RASPBERRY_PI.16 25.4,95.3 26.42,95.3 29.87,98.75 62.79,98.75 69.39,92.15 69.39,90.53 73.56,86.36 HX711-4.5
  Bottom 0.152: HX711-4.5 73.56,86.36 73.56,85.24 69.6,81.28 GROVE4.2
HX711-DT_GPIO25_PIN22
  Top 0.152: GROVE5.2 18.9,64.92 18.9,67.46 HX711-5.2 31.6,84.94 31.6,92.96 33.02,94.39 RASPBERRY_PI.22
HX711-DT_RPI-GPIO12_PIN32
  Top 0.152: GROVE2.2 37.29,77.52 37.29,80.47 35.26,82.5 HX711-2.2 35.26,82.6 44.3,91.64 44.3,92.86 45.72,94.28 RASPBERRY_PI.32
HX711-DT_RPI-GPIO27_PIN13
  Bottom 0.152: GROVE3.2 51.71,77.52 51.71,80.37 HX711-3.2 46.84,85.24 31.29,85.24 23.88,92.66 22.86,92.66 RASPBERRY_PI.13
HX711-SCK_GPIO6_PIN31
  Top 0.152: 8.94,79.65 7.01,79.65 HX711-1.3 | 8.94,79.65 17.27,79.65 20.12,82.5 20.73,82.5 GROVE1.1 20.83,82.6 26.52,88.29 26.52,92.96 27.43,93.88 28.14,93.88 29.06,94.79 29.06,95.4 30.07,96.42 46.13,96.42 46.84,95.71 46.84,94.79 45.72,93.67 RASPBERRY_PI.31 | 8.94,79.65 8.94,74.17 7.01,72.24 7.01,72.03 HX711-1.6
HX711-SCK_GPIO24_PIN18
  Top 0.152: 71.48,83.46 68.58,86.36 HX711-4.3 68.48,86.36 68.48,92.46 62.59,98.35 31.39,98.35 28.35,95.3 27.94,95.3 RASPBERRY_PI.18 | 71.48,83.46 71.53,83.41 71.53,81.28 GROVE4.1 | HX711-4.6 76.1,86.36 73.25,83.52 71.53,83.52 71.48,83.46
HX711-SCK_RPI-GPIO13_PIN33
  Top 0.152: GROVE2.1 39.32,77.52 39.32,80.97 37.8,82.5 HX711-2.3 37.8,82.6 47.85,92.66 48.26,92.66 RASPBERRY_PI.33
HX711-SCK_RPI-GPIO22_PIN15  (via drill 0.3)
  Top 0.152: v49.17,85.14 49.48,85.14 HX711-3.3
  Bottom 0.152: GROVE3.1 53.75,77.52 53.75,79.25 52.12,80.87 52.12,82.5 HX711-3.3 | v49.17,85.14 42.06,92.25 42.06,92.86 41.05,93.88 27.43,93.88 26.31,92.76 25.4,92.76 RASPBERRY_PI.15
HX711_V  (via drill 0.3)
  Top 0.152: HX711-3.4 49.89,77.83 49.89,77.52 GROVE3.3 | GROVE4.3 67.06,81.28 66.04,82.3 v56.59,82.3 | HX.1 33.02,63.5 HX711_RPI/LM33.2 38.81,69.29 38.81,70.31 38.1,71.02 27.94,71.02 26.82,69.9 21.64,69.9 HX711-5.4
  Bottom 0.152: GROVE5.3 16.97,64.92 16.97,65.23 HX711-5.4 12.6,78.84 | 12.6,78.84 10.87,77.11 7.01,77.11 HX711-1.4 | 12.6,78.84 16.26,82.5 16.76,82.5 GROVE1.3 | GROVE4.3 67.67,81.28 67.67,83.01 71.02,86.36 HX711-4.4 | v56.59,82.3 54.86,82.3 HX711-3.4 | HX711_RPI/LM33.2 34.85,69.29 34.85,70.31 35.26,70.71 35.26,77.42 GROVE2.3 35.36,77.52 40.34,82.5 HX711-2.4 40.34,82.4 44.4,82.4 49.28,77.52 49.78,77.52 GROVE3.3
I²C_V
  Top 0.152: I²C.3 72.95,28.65 62.48,28.65 60.55,26.72 60.05,26.72 BME680_GROVE.3 | BME680.1 43.18,25.5 38.71,21.03 38.71,11.48 40.64,9.55 PCF8591_I²C.1
  Bottom 0.152: I²C_RPI/LM33.2 34.34,34.24 35.66,34.24 43.18,26.72 BME680.1 43.18,26.82 45.01,28.65 57.51,28.65 59.44,26.72 59.94,26.72 BME680_GROVE.3
LED_2
  Top 0.152: 51.21,64.62 51.21,64.41 TASTER_LED.3 | 51.21,64.62 51.21,66.04 LED.1 | JP_R_LED.2 60.76,64.31 57.4,60.96 R_LED.2 55.88,61.27 52.53,64.62 51.21,64.62
LED_GPIO21_PIN40
  Top 0.152: R_LED.1 63.5,64.21 63.4,64.31 JP_R_LED.1 63.3,64.41 61.37,66.34 60.05,66.34 55.98,70.41 55.98,83.62 54.66,84.94 54.66,93.17 55.88,94.39 RASPBERRY_PI.40
N$2
  Top 0.152: I²C_RPI/LM33.3 34.24,36.88 27.94,36.88 LF33_I²C.3
  Bottom 0.152: C_I²C_2.+ 26.92,43.28 25.5,41.86 25.5,39.32 27.94,36.88 LF33_I²C.3
N$3
  Top 0.152: TASTER.1 33.53,16.56 33.53,21.64 34.95,23.06 S_TASTER.4 35.05,23.16 35.05,25.3 41.96,32.21 41.96,42.37 44.91,45.31 44.91,51.31 51.66,58.06 | TASTER_LED.2 51.66,58.06 | 51.66,58.06 52.53,57.2 55.88,57.2 R_TASTER.1
N$4
  Top 0.152: LF33_HX711.3 31.04,68.02 | 31.04,68.02 31.09,67.97 31.09,57.4 34.24,54.25 34.24,48.97 C_HX711_2.+ | 31.04,68.02 32.82,69.8 36.78,69.8 HX711_RPI/LM33.3
N$8
  Top 0.152: #76_77.1 39.42,24.18 39.42,24.38 41.96,26.92 41.96,27.84 42.77,28.65 51.41,28.65 53.34,26.72 BME680.5
N$9
  Bottom 0.5: 5V(ALTERN.IN).1 2.54,19 12.7,29.16 F2.2
RX_0_PIN_10
  Top 0.152: UART_GROVE.1 70.41,98.04 64.11,98.04 62.99,99.16 21.64,99.16 17.78,95.3 RASPBERRY_PI.10
SPANNUNGSTEILER1
  Top 0.152: R1_PCF8591.2 62.69,17.78 58.93,14.02 53.34,14.02 R2_PCF8591.1 53.34,13.92 52.63,13.92 44.81,6.1 PCF8581_MP.1
TASTER_GPIO16_PIN36
  Top 0.152: R_TASTER.2 63.5,57.2 67.26,57.2 C_TASTER.2
  Bottom 0.152: RASPBERRY_PI.36 50.8,94.28 52.22,92.86 52.22,87.58 57.2,82.6 57.2,73.15 56.79,72.75 56.79,63.91 63.5,57.2 R_TASTER.2
TX_0_PIN_8
  Bottom 0.152: UART_GROVE.2 70.41,96.01 64.92,96.01 62.59,98.35 18.29,98.35 15.24,95.3 RASPBERRY_PI.8
VDD20V1
  Top 0.25: R1_PCF8591.1 52.02,17.78 42.06,7.82 27.84,7.82 17.48,18.19 17.48,20.02 16.97,20.52 12.9,20.52 F1.1 12.7,20.22 10.06,17.58 10.06,15.85 2.54,8.33 DCIN+.1
VDD20V2
  Top 0.25: F1.2 12.9,15.04 17.78,15.04 30.28,2.54 POWER_IN.1

### Text on the board
Top: MD
tNames: 5V / / 5V / / GND / / G14 / / G15 / / G18 / / GND / / G23 / / G24 / / GND / / G25 / / G8 / / G7 / / IDSC / / GND / / G12 / / GND / / G16 / / G20 / / G21 | 2 / 1 | 40 / / 39 | 3V3 / / G2 / / G3 / / G4 / / GND / / G17 / / G27 / / G22 / / 3v3 / / G10 / / G9 / / G11 / / GND / / IDSD / / G5 / / G6 / / G13 / / G19 / / G26 / / GND | GND / / DT / / SCK / / 3V3 / / (DT/DAT) / / (SCK) / / (GND) | GND / / DT / / SCK / / 3V3 | GND / / DT / / SCK / / 3V3 | GND / / DT / / SCK / / 3V3 | GND / / 3v3 / / DT / / SCK | 3V3 / / (DT/DAT) / / (SCK) / / (GND) | GND / / 3v3 / / DT / / SCK | GND / / 3v3 / / DT / / SCK | GND / / 3v3 / / DT / / SCK | GND / / DT / / SCK / / 3V3 | LED- / / NotC / / NotC / / LED+ | PIN3 / | LM 3v3 / PIN2 / | RPi 3v3 / PIN1 | GND / / 3v3 / / DT / / SCK | Taster / / Taster / / LED + / / LED - | GPIO9 / | V GPIO / DS18B20 / | V Rpi / Rpi 3v3 | GND / / 3V3 / / / DATA | GND / / 3V3 / / / DATA | PIN3 / | LM 3v3 / PIN2 / | RPi 3v3 / PIN1 | + | 3V3 / / GND / / SCL / / SDA / / SDO | SDA / / SCL / / 3.3V / / GND | - | GND / / 3.3V / / SDA(!) / / SCL(!) | 5V | SCL / / SDA / / GND / / 3.3V | - | - | + | - | 5V / | W off / To Rpi / / / / / GND | HoneyPi HAT 2.02 / https://www.honey-pi.de | V_PCF8591 / / GND | (!) Pinout modified to 2.01! / Check documentation. | + | - | 7-16,5V 1A(max)